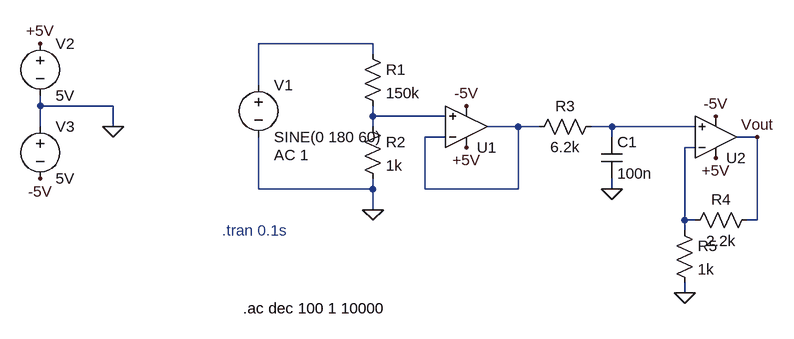
[diagram p0: schematic Draft2.asc]
Draft2.asc, the LTspice schematic file:
Version 4
SHEET 1 1180 680
WIRE 176 96 0 96
WIRE 176 112 176 96
WIRE 0 160 0 96
WIRE -336 192 -336 176
WIRE -224 192 -336 192
WIRE 176 208 176 192
WIRE 288 208 176 208
WIRE -336 224 -336 192
WIRE -224 224 -224 192
WIRE 176 224 176 208
WIRE 400 224 352 224
WIRE 432 224 400 224
WIRE 544 224 512 224
WIRE 672 224 544 224
WIRE 288 240 256 240
WIRE 544 240 544 224
WIRE 768 240 736 240
WIRE 672 256 656 256
WIRE 0 320 0 240
WIRE 176 320 176 304
WIRE 176 320 0 320
WIRE 256 320 256 240
WIRE 400 320 400 224
WIRE 400 320 256 320
WIRE 544 320 544 304
WIRE 176 352 176 320
WIRE 656 368 656 256
WIRE 672 368 656 368
WIRE 768 368 768 240
WIRE 768 368 752 368
WIRE 656 384 656 368
WIRE 656 480 656 464
FLAG 176 352 0
FLAG 320 192 -5V
FLAG 320 256 +5V
FLAG 704 272 +5V
FLAG 704 208 -5V
FLAG 544 320 0
FLAG 656 480 0
FLAG 768 240 Vout
FLAG -224 224 0
FLAG -336 96 +5V
FLAG -336 304 -5V
SYMBOL res 160 96 R0
SYMATTR InstName R1
SYMATTR Value 150k
SYMBOL res 160 208 R0
SYMATTR InstName R2
SYMATTR Value 1k
SYMBOL voltage 0 144 R0
WINDOW 123 24 124 Left 2
WINDOW 39 0 0 Left 0
SYMATTR Value2 AC 1
SYMATTR InstName V1
SYMATTR Value SINE(0 180 60)
SYMBOL OpAmps\\UniversalOpAmp 320 224 M180
SYMATTR InstName U1
SYMBOL OpAmps\\UniversalOpAmp 704 240 M180
SYMATTR InstName U2
SYMBOL res 528 208 R90
WINDOW 0 0 56 VBottom 2
WINDOW 3 32 56 VTop 2
SYMATTR InstName R3
SYMATTR Value 6.2k
SYMBOL cap 528 240 R0
SYMATTR InstName C1
SYMATTR Value 100n
SYMBOL res 768 352 R90
WINDOW 0 0 56 VBottom 2
WINDOW 3 32 56 VTop 2
SYMATTR InstName R4
SYMATTR Value 2.2k
SYMBOL res 640 368 R0
SYMATTR InstName R5
SYMATTR Value 1k
SYMBOL voltage -336 80 R0
WINDOW 123 0 0 Left 0
WINDOW 39 0 0 Left 0
SYMATTR InstName V2
SYMATTR Value 5V
SYMBOL voltage -336 208 R0
WINDOW 123 0 0 Left 0
WINDOW 39 0 0 Left 0
SYMATTR InstName V3
SYMATTR Value 5V
TEXT -56 384 Left 2 ;.tran 0.1s
TEXT -24 504 Left 2 !.ac dec 100 1 10000

The netlist it stands for:
* Draft2.asc
R1 N001 N002 150k
R2 N002 0 1k
V1 N001 0 SINE(0 180 60) AC 1
XU1 N002 N003 +5V -5V N003 level1 Avol=1Meg GBW=10Meg Vos=0 En=0 Enk=0 In=0 Ink=0 Rin=500Meg  ; pins In+ In- V+ V- OUT
XU2 N004 N005 +5V -5V Vout level1 Avol=1Meg GBW=10Meg Vos=0 En=0 Enk=0 In=0 Ink=0 Rin=500Meg  ; pins In+ In- V+ V- OUT
R3 N004 N003 6.2k
C1 N004 0 100n
R4 Vout N005 2.2k
R5 N005 0 1k
V2 +5V 0 5V
V3 0 -5V 5V
* .tran 0.1s
.ac dec 100 1 10000
.lib UniversalOpAmp1.lib
.backanno
.end